# EAGLE schematic ThreeDigitDisplay (EAGLE 7.5.0)
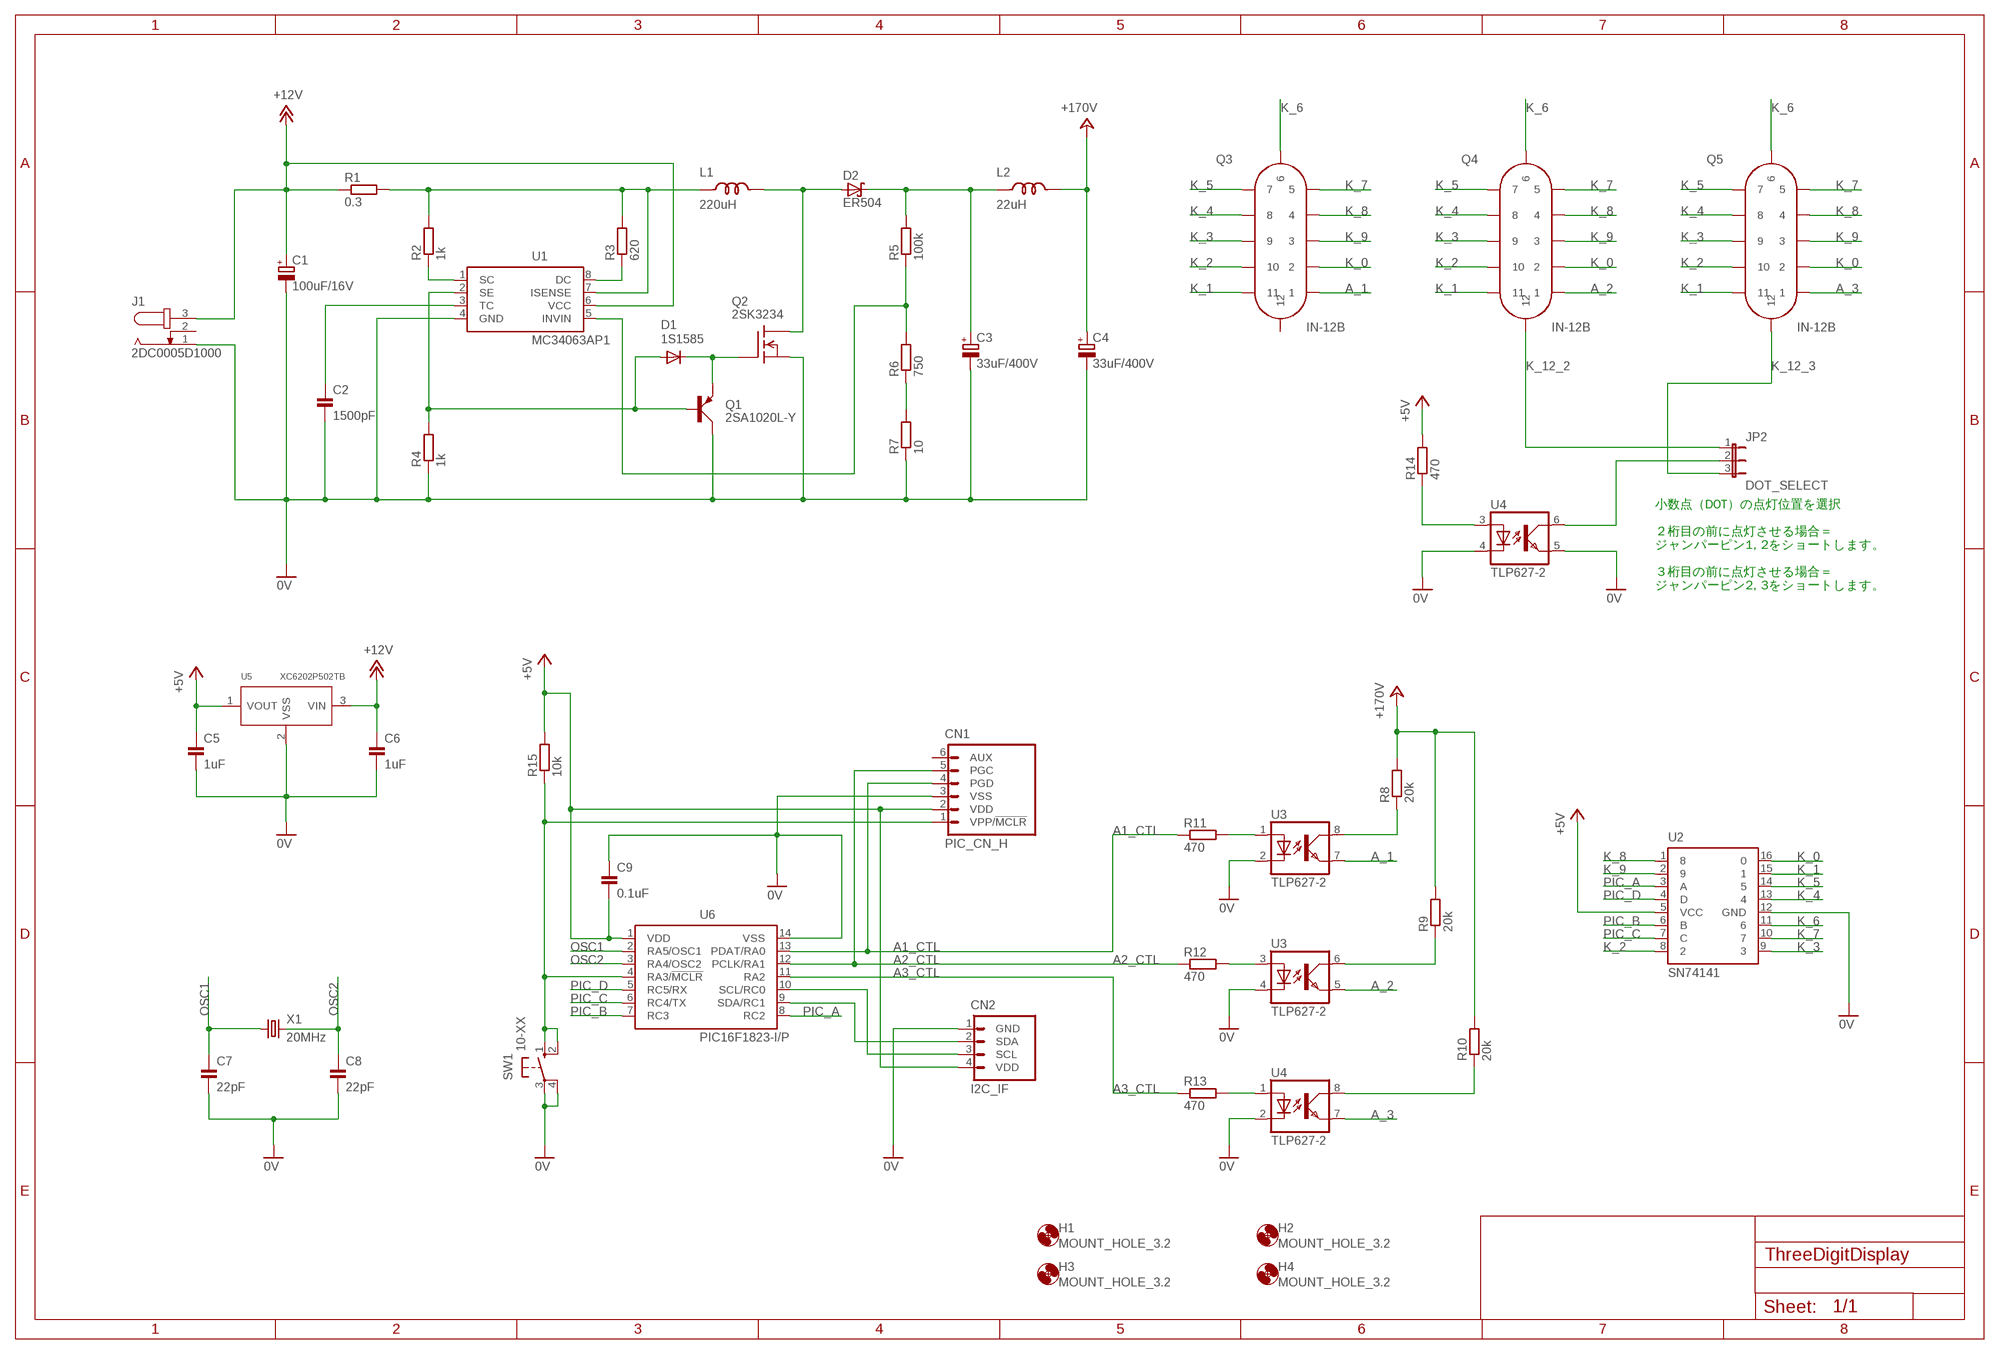
[diagram p0: schematic, sheet 1]

## Parts
C1  100uF/16V  ELECAP_200MIL  [ELECAP_200MIL]
C2  1500pF  CAP_200MIL  [CAP_200MIL]
C3  33uF/400V  ELECAP_300MIL  [ELECAP_300MIL]
C4  33uF/400V  ELECAP_300MIL  [ELECAP_300MIL]
C5  1uF  CAP_200MIL  [CAP_200MIL]
C6  1uF  CAP_200MIL  [CAP_200MIL]
C7  22pF  CAP_200MIL  [CAP_200MIL]
C8  22pF  CAP_200MIL  [CAP_200MIL]
C9  0.1uF  CAP_200MIL  [CAP_200MIL]
CN1  PIC_CN_H  [HEADER_6PIN]
CN2  I2C_IF  [I2C_IF]
D1  1S1585  [DIODE-200MIL]
D2  ER504  [DIODE-500MIL]
H1  MOUNT_HOLE_3.2  [3,2]
H2  MOUNT_HOLE_3.2  [3,2]
H3  MOUNT_HOLE_3.2  [3,2]
H4  MOUNT_HOLE_3.2  [3,2]
J1  2DC0005D1000  [DCJACK_2.1_5.5]
JP2  DOT_SELECT  JP2E  [JP2]
L1  220uH  TC5026-220UH-050  [TOROID_COIL-300MIL]
L2  22uH  TC5026-22UH-060  [TOROID_COIL-300MIL]
Q1  2SA1020L-Y  [TO-92NL]
Q2  2SK3234  [TO-220]
Q3  IN-12B  [IN-12]
Q4  IN-12B  [IN-12]
Q5  IN-12B  [IN-12]
R1  0.3  RESISTOR_600MIL  [RESISTOR_0411_600MIL]
R2  1k  RESISTOR_600MIL  [RESISTOR_0411_600MIL]
R3  620  RESISTOR_600MIL  [RESISTOR_0411_600MIL]
R4  1k  RESISTOR_600MIL  [RESISTOR_0411_600MIL]
R5  100k  RESISTOR_600MIL  [RESISTOR_0411_600MIL]
R6  750  RESISTOR_600MIL  [RESISTOR_0411_600MIL]
R7  10  RESISTOR_600MIL  [RESISTOR_0411_600MIL]
R8  20k  RESISTOR_300MIL  [RESISTOR_0207_300MIL]
R9  20k  RESISTOR_600MIL  [RESISTOR_0411_600MIL]
R10  20k  RESISTOR_300MIL  [RESISTOR_0207_300MIL]
R11  470  RESISTOR_300MIL  [RESISTOR_0207_300MIL]
R12  470  RESISTOR_300MIL  [RESISTOR_0207_300MIL]
R13  470  RESISTOR_300MIL  [RESISTOR_0207_300MIL]
R14  470  RESISTOR_300MIL  [RESISTOR_0207_300MIL]
R15  10k  RESISTOR_300MIL  [RESISTOR_0207_300MIL]
SW1  10-XX  [B3F-10XX]
U1  MC34063AP1  [DIL08]
U2  SN74141  [DIL16]
U3  TLP627-2  [DIL08]
U4  TLP627-2  [DIL08]
U5  XC6202P502TB  [TO92-LINE]
U6  PIC16F1823-I/P  [DIL14]
X1  20MHz  HUSG-20.000-20  [HC-49/S]

## Nets
0V: C1.- C2.2 C3.- C4.- C5.2 C6.2 C7.2 C8.2 C9.1 CN1.3(VSS) CN2.1(GND) J1.1 Q1.2(C) Q2.3(S) R4.1 R7.1 SW1.3(P) SW1.4(P1) U1.4(GND) U2.12(GND) U3.2(C) U3.4(C) U4.2(C) U4.4(C) U4.5(EMIT) U5.2(VSS) U6.14(VSS)
+5V: C5.1 C9.2 CN1.2(VDD) CN2.4(VDD) R14.2 R15.2 U2.5(VCC) U5.1(VOUT) U6.1(VDD)
+12V: C1.+ C6.1 J1.3 R1.1 U1.6(VCC) U5.3(VIN)
+24V: C4.+ L2.2 R8.2 R9.2 R10.2 ; supply symbol labelled +170V
A1_CTL: CN1.4(PGD) R11.1 U6.13(PDAT/RA0)
A2_CTL: CN1.5(PGC) R12.1 U6.12(PCLK/RA1)
A3_CTL: R13.1 U6.11(RA2)
A_1: Q3.1 U3.7(EMIT)
A_2: Q4.1 U3.5(EMIT)
A_3: Q5.1 U4.7(EMIT)
K_0: Q3.2 Q4.2 Q5.2 U2.16
K_1: Q3.11 Q4.11 Q5.11 U2.15
K_2: Q3.10 Q4.10 Q5.10 U2.8
K_3: Q3.9 Q4.9 Q5.9 U2.9
K_4: Q3.8 Q4.8 Q5.8 U2.13
K_5: Q3.7 Q4.7 Q5.7 U2.14
K_6: Q3.6 Q4.6 Q5.6 U2.11
K_7: Q3.5 Q4.5 Q5.5 U2.10
K_8: Q3.4 Q4.4 Q5.4 U2.1
K_9: Q3.3 Q4.3 Q5.3 U2.2
K_12_2: JP2.1 Q4.12
K_12_3: JP2.3 Q5.12
N$1: R3.1 U1.8(DC)
N$2: C3.+ D2.C L2.1 R5.2
N$3: C2.1 U1.3(TC)
N$4: R2.1 U1.1(SC)
N$5: L1.1 R1.2 R2.2 R3.2 U1.7(ISENSE)
N$6: R5.1 R6.2 U1.5(INVIN)
N$7: D1.A Q1.3(B) R4.2 U1.2(SE)
N$8: D1.C Q1.1(E) Q2.1(G)
N$9: R6.1 R7.2
N$10: D2.A L1.2 Q2.2(D)
N$11: R8.1 U3.8(COL)
N$12: R9.1 U3.6(COL)
N$13: R11.2 U3.1(A)
N$14: R12.2 U3.3(A)
N$15: R14.1 U4.3(A)
N$16: R13.2 U4.1(A)
N$17: CN1.1(VPP/!MCLR) R15.1 SW1.1(S) SW1.2(S1) U6.4(RA3/!MCLR!)
N$18: JP2.2 U4.6(COL)
N$19: R10.1 U4.8(COL)
N$20: CN2.2(SDA) U6.9(SDA/RC1)
N$21: CN2.3(SCL) U6.10(SCL/RC0)
OSC1: C7.1 U6.2(RA5/OSC1) X1.1
OSC2: C8.1 U6.3(RA4/OSC2) X1.2
PIC_A: U2.3(A) U6.8(RC2)
PIC_B: U2.6(B) U6.7(RC3)
PIC_C: U2.7(C) U6.6(RC4/TX)
PIC_D: U2.4(D) U6.5(RC5/RX)
Unconnected: CN1.6(AUX) J1.2 Q3.12

## Notes on the sheet
- 小数点（DOT）の点灯位置を選択
  
  ２桁目の前に点灯させる場合＝
  ジャンパーピン1, 2をショートします。
  
  ３桁目の前に点灯させる場合＝
  ジャンパーピン2, 3をショートします。

## Library data of the parts
C1 C3 C4 = Parts:ELECAP: 電解コンデンサー
C2 C5-C9 = Parts:CAP: コンデンサー
CN1 = Connectors:PIC_CN: PICKit 3 インターフェースピン
CN2 = PartsForProto:I2C_IF: I2C インターフェース
D1 = Parts:1S1585: 汎用小信号ダイオード ◆電気的特性 ・順電圧（ＶF）：１．０Ｖ＠ＩF＝１００ｍＡ ・逆電流（ＩR）：０．５μＡ＠ＶR＝８０Ｖ ・端子間容量ＣT）：２ｐＦ＠ＶR＝０Ｖ、１ＭＨｚ ・逆回復時間(ｔrr)：２ｎＳ＠ＶR＝６Ｖ、ＩF＝１０ｍＡ、ＲL＝１００Ω
D2 = Parts:ER504: ファストリカバリ・ダイオード ・耐圧：４００Ｖ ・電流：５Ａ ・ＶＦ：１．２５Ｖ（＠５Ａ） ・Ｉｒ：５μＡ（＠２５℃） ・回復時間（Ｔｒｒ）：３５ｎｓ ・接合容量：６５ｐＦ
H1-H4 = Generic:MOUNT_HOLE
J1 = Connectors:2DC0005D100: ２．１ｍｍ標準ＤＣジャック（４Ａ） 内径２．１ｍｍ外径５．５ｍｍ ＭＪ－１７９Ｐ（マル信無線電機）と同一形状です. SINGATRON ENTERPRISE CO., LTD 2DC0005D100 http://akizukidenshi.com/catalog/g/gC-01604/; OC_FARNELL: unknown; OC_NEWARK: unknown
JP2 = Parts:JP2E: JUMPER
L1 = Parts:TC5026-220UH-050: 電力用インダクタ 公称インダクタンス：220μH±10％ （＠1KHz/0.25V） 定格電流：5A 寸法：φD=15、H=7、φd=0.5、L=10（単位：mm）
L2 = Parts:TC5026-22UH-060: 電力用インダクタ 公称インダクタンス：22μH±10％ （＠1KHz/0.25V） 直流抵抗：650mΩ 定格電流：6A 寸法：φD=15、H=6.5、φd=0.6、L=8（単位：mm）
Q1 = Parts:2SA1020L: シリコンＰＮＰエピタキシャルトランジスタ ・ＶＣＢＯ：－５０Ｖ ・ＶＣＥＯ：－５０Ｖ ・ＶＥＢＯ：－５Ｖ ・ＩＣ：－２Ａ ・ＰＣ：９００ｍＷ（ＴＡ＝２５℃） ・パッケージ：ＴＯ－９２（ＥＣＢ）
Q2 = Parts:2SK3234: Ｎチャンネル高耐圧パワーＭＯＳＦＥＴ ■電源，ＤＣ－ＤＣコンバータ向け ・耐圧（ＶＤＳＳ）：５００Ｖ ・ＩＤ＝８Ａ ・低オン抵抗：ＲＤＳ＝０．６５Ω ・スイッチングスピード：ｔｆ＝２５ｎｓ
Q3-Q5 = Parts:IN-12*: ニキシー管
R1-R15 = Parts:RESISTOR: 抵抗器
SW1 = Parts:10-XX: TACT SWITCH
U1 = Parts:MC34063A*: DC/DCスイッチングレギュレータ ■生産中止品 ■スイッチ電流: 1.5A (MAX) ■発振周波数: 100kHz ■過電流検出回路内蔵 ■電源電圧: 3V~40V ■出力電圧 :1.25V~40V ■動作温度 : 0°C～70°C
U2 = Parts:SN74141: BCD-TO-DECIMAL DECORDER/DRIVER
U3 U4 = Parts:TLP627*: ２回路入フォトカプラ TLP627-2 ・パッケージ：８ピンＤＩＰ ・ＩＣ：１５０ｍＡ ・変換効率：４０００％ ｔｙｐ． ・動作温度：－５５℃～１００℃ ・絶縁耐圧：５０００Ｖｒｍｓ ｍｉｎ．（＠６０ｓｅｃ）
U5 = Parts:XC6202*: 低損失ＣＭＯＳ三端子レギュレーター ・定格出力：５Ｖ ・最大出力電流：１５０ｍＡ以上 ・入力最大電圧：２０Ｖ ・入出力電圧差： ０．２Ｖ（３０ｍＡ時） ０．６７Ｖ（１００ｍＡ時） ・低消費電流：１０μＡ
U6 = Parts:PIC16F1823*: 14-Pin Flash Microcontrollers ・プログラムメモリ：２Ｋワード ・ＲＡＭ：１２８バイト ・ＥＥＰＲＯＭ：２５６バイト ・Ｉ／Ｏ：最大１２本 ・ＡＤコンバータ：１０ビットｘ８ｃｈ ・コンパレータ：２ｃｈ ・タイマー：８ビットｘ２，１６ビットｘ１ ・電源電圧：１．８Ｖ（１６ＭＨｚ ＭＡＸ）～５．５Ｖ（３２ＭＨｚ ＭＡＸ） ・動作クロック：３２ＭＨｚ ＭＡＸ
X1 = Parts:HUSG-*: クリスタル（水晶発振子） 小型のＨＣ－４９／Ｓ型パッケージです。 ・２０ＭＨｚ ・負荷容量：２０ｐＦ ・周波数偏差：±３０ｐｐｍ（２５℃）